# EAGLE board 519_jetson_nano10120 (EAGLE 9.6.2)
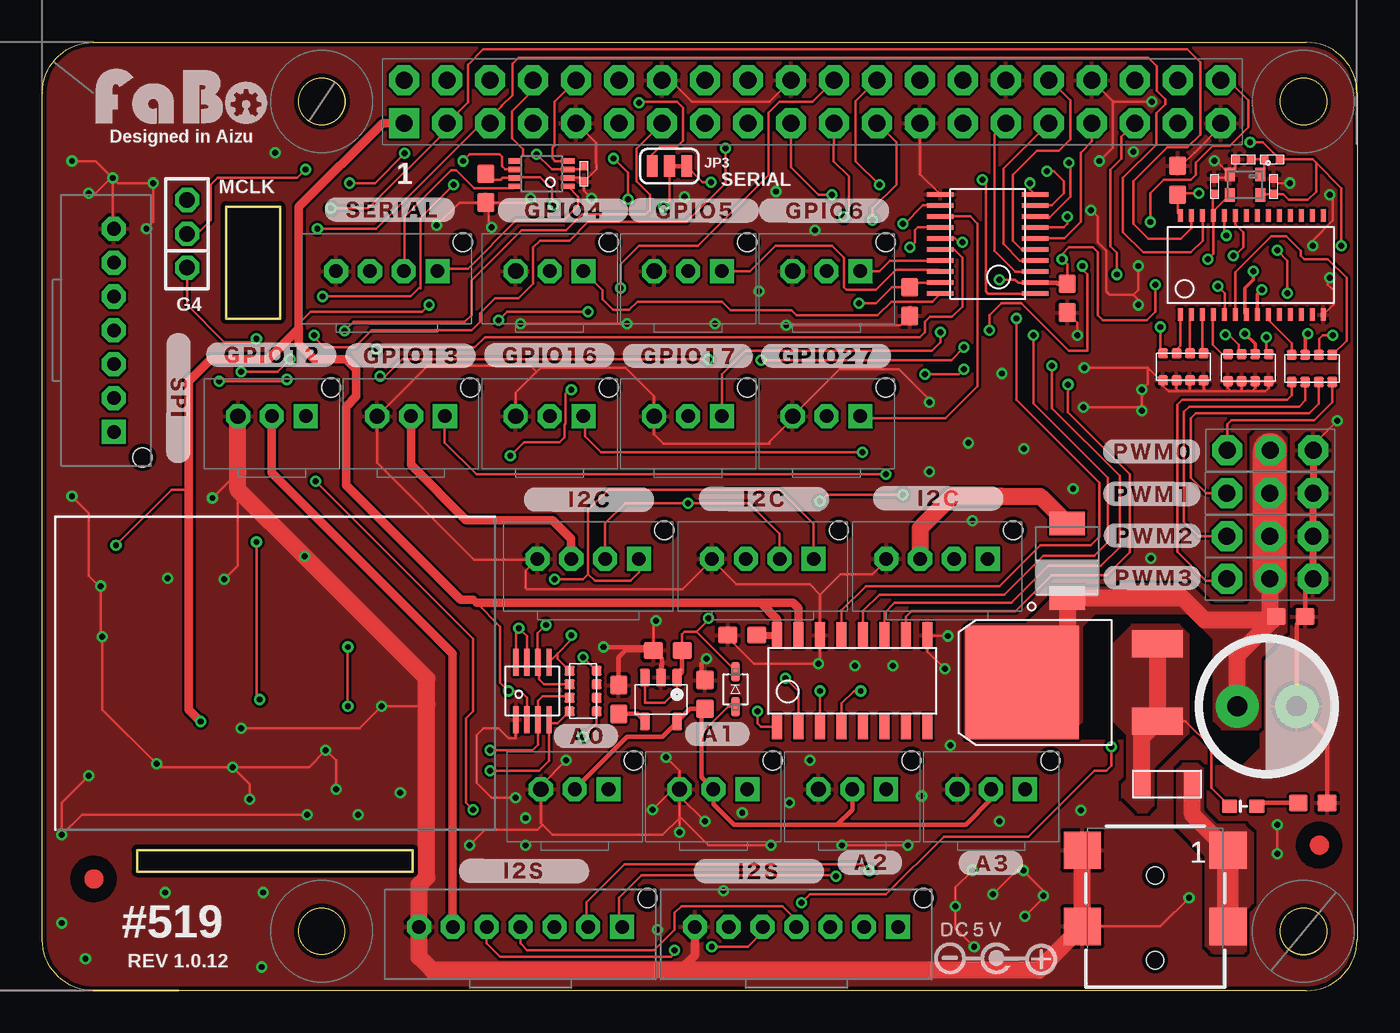
[diagram p1: board, top side]
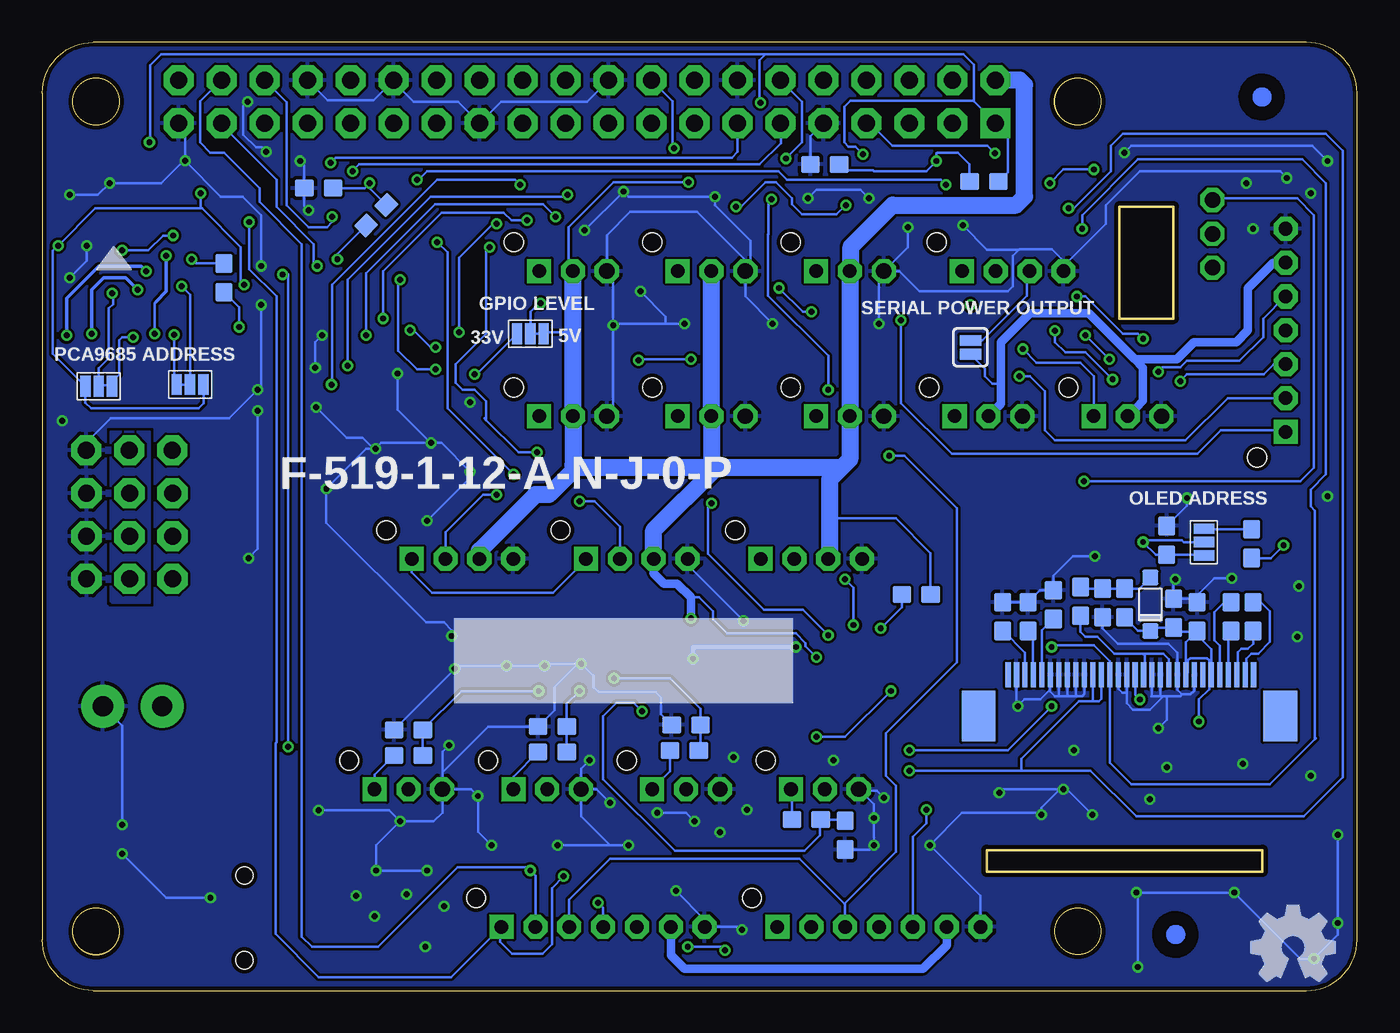
[diagram p2: board, bottom side, seen from below]

Size 70.28 x 51.77 mm. Coordinates in mm from the lower left corner, seen from the top.
Outline: 0,4.91 16.28,4.91 16.28,6.18 0,6.18 0,4.91
Outline: 5.25,44.17 8.45,44.17 8.45,37.58 5.25,37.58 5.25,44.17
Outline: circle at 10.91,50.4 radius 1.38
Outline: circle at 68.9,50.38 radius 1.38
Outline: circle at 10.9,1.38 radius 1.38
Outline: circle at 68.9,1.38 radius 1.38
Copper layers (1*16): Top 0.035mm / dielectric 1.6mm / Bottom 0.035mm
Design rules "PCBway": minimum track width 6mil, minimum drill 12mil, track to track 6mil, track to pad 6mil, pad to pad 6mil, via to via 6mil, smd to smd 6mil, copper to edge 10mil, drill to drill 10mil, minimum pad ring 10mil, minimum via ring 6mil, stop-mask expansion 2mil, vias tented up to drill 100mil, thermal gap 8mil
tKeepout: area -4.7,7.6 to 20.8,25.5
bKeepout: area -2.2,5.6 to 18.6,17.9; area 62.9,43.2 to 66.8,46.8
tRestrict: 12 lines
bRestrict: 8 lines

## Footprints (pad centres in the part's own frame; a part is rotated, then mirrored left to right if it is on the bottom)
FABO_BRICK_3PIN_B03B-PASK-1 = drill 0.9 pad 1.422 octagon: GND -2,0 | drill 0.8 pad 1.422 square: I/O 2,0 | drill 0.8 pad 1.422 octagon: VCC 0,0 | hole 1.1: 3.5,1.7
0603 = smd 1.1 x 1: 1 -0.85,0; 2 0.85,0
0402 = smd 0.5 x 0.5: P$1 -0.46,0; P$2 0.46,0
E7(PANA) = drill 1.2 pad 2.54: MINUS 1.75,0; PLUS -1.75,0
1N4148W = smd 0.9 x 0.95: ANODE 0,0; CATHODE 3.15,0
SOD-323 = smd 1.14 x 0.52: A 1.04,0; C -1.04,0
FABO_BRICK_I2C_B04B-PASK-1 = drill 0.8 pad 1.422 octagon: GND -3,0; SDA 1,0; VCC -1,0 | drill 0.8 pad 1.422 square: SCL 3,0 | hole 1.1: 4.5,1.7
SPI-B07B-PASK-1 = drill 0.8 pad 1.422 octagon: 1 -6,1.27; 2 -4,1.27; 3 -2,1.27; 4 0,1.27; 5 2,1.27; 6 4,1.27 | drill 0.8 pad 1.422 square: 7 6,1.27 | hole 1.1: 7.5,2.97
8PIN-SSOP = smd 0.3 x 1.6: 1 -0.975,-1.7; 2 -0.325,-1.7; 3 0.325,-1.7; 4 0.975,-1.7; 5 0.975,1.7; 6 0.325,1.7; 7 -0.325,1.7; 8 -0.975,1.7
MICROCHIP-MCP3008 = smd 0.6 x 1.5: 1 -4.445,-2.7; 2 -3.175,-2.7; 3 -1.905,-2.7; 4 -0.635,-2.7; 5 0.635,-2.7; 6 1.905,-2.7; 7 3.175,-2.7; 8 4.445,-2.7; 9 4.445,2.7; 10 3.175,2.7; 11 1.905,2.7; 12 0.635,2.7; 13 -0.635,2.7; 14 -1.905,2.7; 15 -3.175,2.7; 16 -4.445,2.7
694103107102 = smd 2.2 x 2.2: 1 4.3,4; 2 -4.3,-0.5; 3 -4.3,4; A1 4.3,-0.5 | hole 1: 0,-2.5; 0,2.5
JUMPERS_JP2-2MM = drill 0.914 octagon: 1 -2,0; 2 0,0; 3 2,0
SMT-JUMPER_2_NC_PASTE_SILK = smd 0.635 x 1.27: 1 -0.406,0; 2 0.406,0
SMT-JUMPER_3_1-NC_TRACE_SILK = smd 0.635 x 1.27: 1 -1.016,0; 2 0,0; 3 1.016,0
0603' = smd 0.9 x 0.8: ANODE -0.8,0; CATHODE 0.8,0
1206 = smd 1 x 1.6: P$1 -1.5,0; P$2 1.5,0
FABO_BRICK_3PIN_HEADER = drill 1 pad 1.778 octagon: GND -2.54,0; I/O 2.54,0; VCC 0,0
EXBV8V = smd 0.6 x 0.6: 1 -1.2,-0.8; 2 -0.4,-0.8; 3 0.4,-0.8; 4 1.2,-0.8; 5 1.2,0.8; 6 0.4,0.8; 7 -0.4,0.8; 8 -1.2,0.8
STPS15L30C = smd 1.6 x 3: A1 -2.286,-6.13; A2 2.286,-6.13 | smd 6.7 x 6.7: K 0,1.87
FABO_BRICK_SERIAL_B04B-PASK-1 = drill 0.8 pad 1.422 octagon: GND -3,0; TX 1,0; VCC -1,0 | drill 0.8 pad 1.422 square: RX 3,0 | hole 1.1: 4.5,1.7
SMD-JUMPER-3 = smd 0.61 x 1.219: 1 -0.787,0; 2 0,0; 3 0.787,0
ER-CON30HT-1 = smd 0.3 x 1.5 bottom: 1 7,-0.23; 2 6.5,-0.23; 3 6,-0.23; 4 5.5,-0.23; 5 5,-0.23; 6 4.5,-0.23; 7 4,-0.23; 8 3.5,-0.23; 9 3,-0.23; 10 2.5,-0.23; 11 2,-0.23; 12 1.5,-0.23; 13 1,-0.23; 14 0.5,-0.23; 15 0,-0.23; 16 -0.5,-0.23; 17 -1,-0.23; 18 -1.5,-0.23; 19 -2,-0.23; 20 -2.5,-0.23; 21 -3,-0.23; 22 -3.5,-0.23; 23 -4,-0.23; 24 -4.5,-0.23; 25 -5,-0.23; 26 -5.5,-0.23; 27 -6,-0.23; 28 -6.5,-0.23; 29 -7,-0.23; 30 -7.5,-0.23 | smd 2 x 3 bottom: 31 -9.07,-2.67; 32 8.74,-2.67
R-PUSON-N20 = smd 0.25 x 1.55: 1 -2.925,-2.8; 2 -2.275,-2.8; 3 -1.625,-2.8; 4 -0.975,-2.8; 5 -0.325,-2.8; 6 0.325,-2.8; 7 0.975,-2.8; 8 1.625,-2.8; 9 2.275,-2.8; 10 2.925,-2.8; 11 2.925,2.8; 12 2.275,2.8; 13 1.625,2.8; 14 0.975,2.8; 15 0.325,2.8; 16 -0.325,2.8; 17 -0.975,2.8; 18 -1.625,2.8; 19 -2.275,2.8; 20 -2.925,2.8
SOT-23-5 = smd 0.6 x 1.05: 1 -0.95,-1.3; 2 0,-1.3; 3 0.95,-1.3; 4 0.95,1.3; 5 -0.95,1.3
JETSON_NANO_COMPA = drill 1 pad 1.778 square: 1 -17.78,15.24 | drill 1 pad 1.778 octagon: 2 -17.78,17.78; 3 -15.24,15.24; 4 -15.24,17.78; 5 -12.7,15.24; 6 -12.7,17.78; 7 -10.16,15.24; 8 -10.16,17.78; 9 -7.62,15.24; 10 -7.62,17.78; 11 -5.08,15.24; 12 -5.08,17.78; 13 -2.54,15.24; 14 -2.54,17.78; 15 0,15.24; 16 0,17.78; 17 2.54,15.24; 18 2.54,17.78; 19 5.08,15.24; 20 5.08,17.78; 21 7.62,15.24; 22 7.62,17.78; 23 10.16,15.24; 24 10.16,17.78; 25 12.7,15.24; 26 12.7,17.78; 27 15.24,15.24; 28 15.24,17.78; 29 17.78,15.24; 30 17.78,17.78; 31 20.32,15.24; 32 20.32,17.78; 33 22.86,15.24; 34 22.86,17.78; 35 25.4,15.24; 36 25.4,17.78; 37 27.94,15.24; 38 27.94,17.78; 39 30.48,15.24; 40 30.48,17.78
VSSOP8 = smd 0.3 x 0.8: 1 -0.75,-1.55; 2 -0.25,-1.55; 3 0.25,-1.55; 4 0.75,-1.55; 5 0.75,1.55; 6 0.25,1.55; 7 -0.25,1.55; 8 -0.75,1.55
PCA9685 = smd 0.3 x 0.75: 1 -4.15,-2.93; 2 -3.5,-2.93; 3 -2.85,-2.93; 4 -2.2,-2.93; 5 -1.55,-2.93; 6 -0.9,-2.93; 7 -0.25,-2.93; 8 0.4,-2.93; 9 1.05,-2.93; 10 1.7,-2.93; 11 2.35,-2.93; 12 3,-2.93; 13 3.65,-2.93; 14 4.3,-2.93; 15 4.3,2.92; 16 3.65,2.92; 17 3,2.92; 18 2.35,2.92; 19 1.7,2.92; 20 1.05,2.92; 21 0.4,2.92; 22 -0.25,2.92; 23 -0.9,2.92; 24 -1.55,2.92; 25 -2.2,2.92; 26 -2.85,2.92; 27 -3.5,2.92; 28 -4.15,2.92
KC2016Z = smd 0.6 x 0.8: #1 -0.9,-0.6; #2 0.9,-0.6; #3 0.9,0.6; #4 -0.9,0.6
SOD-128 = smd 1.4 x 2.1: A -2.2,0; K 2.2,0

## Placement (x,y rotation side)
A0  [FABO_BRICK_3PIN_B03B-PASK-1]  25.85,9.77 0 top
A1  [FABO_BRICK_3PIN_B03B-PASK-1]  34.05,9.77 0 top
A2  [FABO_BRICK_3PIN_B03B-PASK-1]  42.25,9.77 0 top
A3  [FABO_BRICK_3PIN_B03B-PASK-1]  50.45,9.77 0 top
C1  10uF  [0603]  15.35,19.98 270 bottom
C2  10uF  [0603]  13.85,19.98 270 bottom
C3  10uF  [0603]  9.45,20.77 90 bottom
C4  1uF  [0603]  1.85,19.98 270 bottom
C5  1uF  [0603]  0.55,19.98 90 bottom
C6  1uF  [0603]  3.85,19.98 270 bottom
C7  0.1uF  [0603]  54.95,38.77 270 top
C8  10uF  [0603]  61.47,45.74 270 top
C9  0.1uF  [0603]  35.75,18.88 0 top
C10  0.1uF  [0603]  45.65,38.58 270 top
C11  1uF  [0603]  31.35,17.98 0 top
C12  0.1uF  [0603]  68.15,19.98 0 top
C13  0.1uF  [0402]  67.15,45.38 270 top
C14  20pF  [0402]  63.65,45.38 270 top
C15  1uF  [0603]  5.25,20.18 270 bottom
C16  0.01uF  [0603]  28.45,15.07 270 top
C17  4.7uF  [0603]  33.55,15.38 270 top
C18  0.1uF  [0402]  26.4,46.12 270 top
C19  0.1uF  [0603]  20.6,45.27 270 top
C100  OSCON  [E7(PANA)]  66.75,14.68 0 top
D1  1N4148  [1N4148W]  6.62,22.27 270 bottom
D2  1N4148WS  [SOD-323]  35.35,15.68 270 top
GPIO4  [FABO_BRICK_3PIN_B03B-PASK-1]  24.37,40.38 0 top
GPIO5  [FABO_BRICK_3PIN_B03B-PASK-1]  32.55,40.38 0 top
GPIO6  [FABO_BRICK_3PIN_B03B-PASK-1]  40.73,40.38 0 top
GPIO12  [FABO_BRICK_3PIN_B03B-PASK-1]  7.96,31.8 0 top
GPIO13  [FABO_BRICK_3PIN_B03B-PASK-1]  16.18,31.8 0 top
GPIO16  [FABO_BRICK_3PIN_B03B-PASK-1]  24.37,31.8 0 top
GPIO17  [FABO_BRICK_3PIN_B03B-PASK-1]  32.55,31.8 0 top
GPIO27  [FABO_BRICK_3PIN_B03B-PASK-1]  40.73,31.8 0 top
I2C0  [FABO_BRICK_I2C_B04B-PASK-1]  26.65,23.38 0 top
I2C1  [FABO_BRICK_I2C_B04B-PASK-1]  36.96,23.38 0 top
I2C2  [FABO_BRICK_I2C_B04B-PASK-1]  47.26,23.38 0 top
I2S0  FABO-I2S-7PIN  [SPI-B07B-PASK-1]  22.65,0.38 0 top
I2S1  FABO-I2S-7PIN  [SPI-B07B-PASK-1]  38.95,0.38 0 top
IC1  [8PIN-SSOP]  23.35,15.57 0 top
IC3  [MICROCHIP-MCP3008]  42.25,16.18 0 top
J1  [694103107102]  60.15,2.18 0 top
JP1  JUMPERS_JP2-2MM  [JUMPERS_JP2-2MM]  2.95,42.58 90 top
JP2  JUMPER-SMT_2_NC_PASTE_SILK  [SMT-JUMPER_2_NC_PASTE_SILK]  17.25,35.88 270 bottom
JP3  JUMPER-SMT_3_1-NC_TRACE_SILK  [SMT-JUMPER_3_1-NC_TRACE_SILK]  31.45,46.58 0 top
LED1  [0603']  65.35,8.77 0 top
LOGO1  [LOGO_FABO_M]  2.62,48.7 0 top
P1  MF-NSML600-2  [1206]  60.85,10.07 180 top
PWM0  [FABO_BRICK_3PIN_HEADER]  66.94,29.8 180 top
PWM1  [FABO_BRICK_3PIN_HEADER]  66.93,27.26 180 top
PWM2  [FABO_BRICK_3PIN_HEADER]  66.93,24.72 180 top
PWM3  [FABO_BRICK_3PIN_HEADER]  66.93,22.2 180 top
R1  10k  [EXBV8V]  61.81,34.72 0 top
R2  10k  [EXBV8V]  65.65,34.67 0 top
R3  220  [EXBV8V]  69.41,34.62 180 top
R4  4.7K/1%  [0603]  26.95,8 0 bottom
R5  1K  [0603]  69.45,8.98 0 top
R6  4.7K  [0603]  5.65,24.48 270 bottom
R7  0  [0402]  67.05,46.98 0 top
R8  10K  [EXBV8V]  26.35,15.57 270 top
R9  200K  [0603]  20.45,21.27 0 bottom
R10  9.1K/1%  [0603]  24.65,7.06 90 bottom
R11  4.7K/1%  [0603]  34.15,12.07 0 bottom
R12  4.7K/1%  [0603]  41.95,11.98 0 bottom
R13  4.7K/1%  [0603]  50.45,11.77 0 bottom
R14  9.1K/1%  [0603]  34.05,13.57 0 bottom
R15  9.1K/1%  [0603]  41.95,13.48 0 bottom
R16  9.1K/1%  [0603]  50.45,13.27 0 bottom
R17  20K  [0603]  16.45,45.67 0 bottom
R18  NC  [0603]  61.35,39.98 90 bottom
R19  390K  [0603]  12.35,20.67 270 bottom
R20  4.7K  [0603]  0.65,24.27 270 bottom
R21  1M  [0603]  25.85,46.67 0 bottom
R22  DNP  [0402]  65.35,46.98 0 top
R23  20K  [0603]  52.35,43.67 225 bottom
R24  1M  [0603]  55.75,45.27 0 bottom
R25  100  [0603]  10.75,20.88 90 bottom
R26  10K  [0603]  8.15,20.77 270 bottom
S1  STPS15L30CB  [STPS15L30C]  54.15,16.07 90 top
SERIAL  [FABO_BRICK_SERIAL_B04B-PASK-1]  14.75,40.38 0 top
SJ2  [SMD-JUMPER-3]  68.75,33.58 0 bottom
SJ3  [SMD-JUMPER-3]  43.25,36.67 0 bottom
SJ5  [SMD-JUMPER-3]  63.35,33.67 180 bottom
SJ6  [SMD-JUMPER-3]  3.45,24.38 270 bottom
SPI1  FABO-SPI-7PIN  [SPI-B07B-PASK-1]  -2.65,36.88 270 top
U1  [ER-CON30HT-1]  8.02,16.77 0 top
U2  TXB0108  [R-PUSON-N20]  50.25,41.98 90 top
U7  LP2985-50  [SOT-23-5]  30.95,15.07 180 top
U$2  JETSON_NANOJETSON_NANO_COMPA  [JETSON_NANO_COMPA]  33.55,33.88 0 top
U$3  [MARK_POINT_3MM]  -2.55,4.48 0 top
U$4  [MARK_POINT_3MM]  69.85,6.48 0 top
U$5  [MARK_POINT_3MM]  5.12,1.2 0 bottom
U$6  [MARK_POINT_3MM]  0.02,50.66 0 bottom
U$7  TXB0102  [VSSOP8]  23.9,46.12 90 top
U$8  LOGO_OSHW-M_BOTTOM  [LOGO_OSHW_M_BOTTOM]  -1.82,0.44 0 top
U$9  PCA9685  [PCA9685]  65.78,40.74 0 top
U$11  KC2016Z  [KC2016Z]  65.45,45.48 180 top
U$12  PMEG10030ELP  [SOD-128]  54.95,23.27 270 top

## Tracks (layer width: path | path; a pad name or v marks a point on that pad's centre or on a via)
3V3  (via drill 0.35)
  Top 0.152: C8.2 61.47,44.83 | v-1.25,24.17 2.05,27.48 3.05,27.48 | v17.25,38.38 16.85,37.98 10.25,37.98 9.55,37.27 | R8.6 R8.5 27.15,13.68 v26.35,12.88 | IC1.2 23.05,13.9 23.05,15.18 22.65,15.57 v21.95,15.57 21.45,16.07 21.45,19.38 20.05,20.77 19.85,20.98 | U$11.#4 66.39,44.91 C13.P$2 67.71,44.91 68.05,44.58 69.15,44.58 69.65,45.08 69.65,46.77 | U$9.28 61.47,43.82 C8.2 | v65.75,47.98 66.51,47.98 R7.P$2 69.45,46.98 69.65,46.77 | C7.1 54.95,40.77 v54.65,41.08 54.65,41.38 55.05,41.77 56.45,41.77 56.75,41.48 56.75,37.77 57.05,37.48 59.65,37.48 60.15,37.98 v60.15,39.58 | v62.72,44.97 61.56,44.97 C8.2 | 69.65,46.77 71.15,45.27 v71.15,41.88 | C18.P$1 26.19,46.38 U$7.3 24.5,46.38 v23.6,47.27 | JP3.1 30.43,47.26 30.9,47.73 31.9,47.73 32.25,48.08 32.25,50.02 31.9,50.38 29.7,50.38 v29.65,50.33 | v46.55,34.27 48.55,34.27 v48.85,34.58 | v50.95,39.88 51.85,39.88 52.05,39.67 53.03,39.67 U2.2
  Top 0.254: C7.1 54.4,39.62 54.35,39.67 53.08,39.67 U2.2
  Top 0.406: C9.2 IC3.16
  Top 0.508: U$2.1 14.49,49.12 9.55,44.17 9.55,37.27 9.55,36.98 | 9.55,36.98 9.55,36.08 10.45,35.17 12.35,35.17 12.95,34.58 12.95,32.98 12.35,32.38 12.35,27.73 19.1,20.98 19.85,20.98 | 9.55,36.98 7.75,35.17 4.35,35.17 3.05,33.88 3.05,27.48 3.05,14.48 v3.75,13.77 | 20.05,20.77 36.85,20.77 | 36.85,20.77 37.8,19.82 IC3.16 | IC3.15 39.08,20.45 38.75,20.77 36.85,20.77
  Bottom 0.152: U1.25 3.02,18.05 3.85,18.88 3.85,19.07 | 3.85,19.07 C6.2 4.52,18.45 U1.22 4.4,16.66 4.4,17.38 4.27,17.51 3.27,17.51 3.14,17.38 3.14,15.69 3.75,15.08 v3.75,13.77 | 3.85,19.07 5,19.07 C15.2 6.42,19.32 D1.CATHODE 7.35,19.12 R26.2 | 29.35,53.17 65.05,53.17 65.7,52.53 65.7,48.02 v65.75,47.98 | 29.35,53.17 17.65,53.17 17.05,52.58 17.05,50.4 | 17.05,50.4 U$2.1 15.05,48.4 15.05,46.23 R17.2 | R20.2 -0.5,23.42 v-1.25,24.17 | v26.35,12.88 24.65,12.88 v21.95,15.57 | v17.25,38.38 17.35,38.27 | R23.2 54.65,41.38 v54.65,41.08 | v60.15,39.58 60.35,39.77 60.35,40.54 60.36,40.55 60.36,41.78 62.65,44.08 | 62.65,44.08 68.95,44.08 v71.15,41.88 71.45,41.58 71.45,35.49 SJ2.1 69.54,32.61 69.2,32.27 62.85,32.27 62.55,32.58 62.55,33.66 SJ5.1 | v62.72,44.97 62.72,44.15 62.65,44.08 | v23.6,47.27 24.05,47.73 24.45,47.73 24.7,47.98 24.7,50.08 24.35,50.42 17.08,50.42 17.05,50.4 | v29.65,50.33 29.7,50.38 29.7,52.83 29.35,53.17 | SJ3.1 46.49,34.22 v46.55,34.27 | v48.85,34.58 49.95,34.58 51.05,35.67 51.05,39.77 v50.95,39.88
5V  (via drill 0.35)
  Top 0.152: U7.1 31.9,15.62 31.15,14.88 30,14.88 U7.3 | U2.19 46.17,39.7 45.9,39.42 C10.1 44.6,39.42 43.65,38.48 v42.65,38.48 | D2.C 35.35,16.77 33.05,19.07 | 33.05,19.07 32.35,19.07 32.2,18.93 C11.2 | R8.7 R8.8 v26.35,17.57 | 33.05,19.07 33.75,19.77 v33.75,19.88 | 50.85,27.38 51.15,27.08 | JP3.3 33.42,45.62 v33.9,45.62
  Top 0.254: U7.1 32.2,16.68 C11.2
  Top 0.508: I2S0.2 18.65,17.77 7.96,28.47 GPIO12.VCC | GPIO13.VCC 16.18,28.95 19.45,25.67 24.55,25.67 25.65,24.58 I2C0.VCC
  Top 1.016: U$12.A 53.35,27.08 51.15,27.08 48.15,27.08 46.26,25.19 I2C2.VCC
  Bottom 0.152: v26.35,17.57 26.99,18.22 26.99,18.41 27.56,18.98 31.62,18.98 32.45,19.8 32.45,20.27 33.28,21.1 33.75,21.1 | R9.2 19.6,23.73 21.65,25.77 25.55,25.77 | v33.9,45.62 37.51,45.62 37.52,45.63 38.34,45.63 41,42.98 41,40.65 GPIO6.VCC | JP2.2 16.4,34.62 16.4,34.17 15.95,33.73 15.45,33.73 | v42.65,38.48 42.75,38.48 43.25,37.98 SJ3.2 SJ3.3 42.36,36.77 40.73,36.77
  Bottom 0.254: 15.56,34.26 15.45,34.38
  Bottom 0.5: 7.46,32.3 GPIO12.VCC | 15.45,32.56 15.45,33.73 15.45,34.38 15.45,36.17 13.75,37.88 10.25,37.88 | v33.75,19.88 33.75,21.1
  Bottom 0.508: 10.25,37.88 7.55,35.17 | 7.55,35.17 7.05,34.67 7.05,32.72 7.46,32.3 | 7.55,35.17 5.05,35.17 4.05,36.17 1.55,36.17 0.85,36.88 0.85,39.38 -0.65,40.88 SPI1.2 | I2S0.2 18.65,0.57 20.05,-0.82 34.15,-0.82 34.95,-0.03 I2S1.2 | 15.45,32.56 15.45,32.53 GPIO13.VCC | 33.75,21.1 34.57,21.92 35.35,21.92 35.96,22.53 I2C1.VCC
  Bottom 1: 14.55,44.27 21.85,44.27 24.3,41.83 | I2C0.VCC 25.55,23.48 25.55,25.77 | I2C1.VCC 35.96,25.06 32.26,28.77
  Bottom 1.016: 32.26,28.77 40.56,28.77 | 40.56,28.77 42.15,27.17 42.95,27.17 46.26,23.87 I2C2.VCC | 14.55,44.27 14.05,44.77 14.05,51.38 14.33,51.66 U$2.2 | 24.86,28.77 24.37,29.26 GPIO16.VCC GPIO4.VCC 24.3,40.45 24.3,41.83 | 24.86,28.77 32.26,28.77 | 25.55,25.77 25.55,28.08 24.86,28.77 | 32.26,28.77 32.55,29.05 GPIO17.VCC GPIO5.VCC | 40.56,28.77 40.73,28.94 GPIO27.VCC 40.73,36.77 GPIO6.VCC
  pour Bottom (no thermals): 65.75,30.88 68.05,30.88 68.05,20.88 67.95,20.77 65.75,20.77
+5
  Top 0.152: D2.A 34.91,14.64 33.35,13.07
  Top 0.254: A0.VCC 28.95,12.88 31.05,12.88 31.9,13.73 U7.5 32.65,14.52 C17.2 33.35,14.32 33.35,13.07 33.35,10.48 A1.VCC 34.05,8.88 35.25,7.68 41.35,7.68 | A2.VCC 42.25,8.57 41.35,7.68 | 41.35,7.68 48.95,7.68 50.45,9.18 A3.VCC
CH0
  Bottom 0.152: R4.1 27.8,9.72 A0.I/O
CH1
  Bottom 0.152: A1.I/O 35,10.82 R11.1
CH2
  Bottom 0.152: R12.1 44.25,10.52 A2.I/O
CH3
  Bottom 0.152: R13.1 52.45,10.62 A3.I/O
GND  (via drill 0.35)
  Top 0.152: R2.1 64.45,33.48 64.65,33.27 | 64.65,33.27 65.15,33.27 | 65.15,33.27 65.25,33.38 R2.2 | R2.3 66.05,33.48 65.85,33.27 | 65.85,33.27 65.15,33.27 | R1.4 63.01,33.42 63.15,33.27 | 63.15,33.27 64.65,33.27 | R1.1 60.61,33.77 | 60.61,33.77 60.61,33.62 60.95,33.27 61.55,33.27 | 61.55,33.27 62.15,33.27 | R1.3 62.21,33.33 62.15,33.27 | R1.2 61.41,33.42 61.55,33.27 | U$9.14 70.68,38.41 70.68,39.24 70.35,39.58 70.35,39.88 v70.45,39.98 | R2.4 66.85,33.48 66.65,33.27 65.85,33.27 | 17.11,14.77 17.01,14.68 v14.45,14.68 13.15,13.38 v6.15,13.38 | v5.15,22.17 5.95,22.98 5.95,27.48 | v4.45,26.98 5.95,28.48 | C11.1 30.5,19.58 v30.65,19.73 | C14.P$1 63.69,45.88 64.35,45.88 U$11.#2 | U$11.#2 64.89,46.41 R22.P$1 | U$2.25 46.25,46.1 U2.11 | U$11.#2 63.74,46.88 v63.64,46.88 | C8.1 61.67,46.59 62.45,47.37 62.48,47.37 64.03,48.92 U$2.39 | v56.85,46.88 57.64,47.67 57.64,48.24 57.65,48.25 57.65,50.41 | U$2.34 57.65,50.41 | 23.95,7.68 23.85,7.77 A0.GND 23.85,9.98 v25.35,11.48 | 23.95,7.68 24.55,7.07 31.05,7.07 32.04,8.06 | 32.05,8.18 32.05,8.07 32.04,8.06 | 32.05,8.18 32.05,9.38 | 32.05,9.38 32.05,9.68 | 32.05,9.68 A1.GND 32.05,10.88 v31.25,11.68 | v37.45,6.48 33.75,6.48 32.05,8.18 | v19.65,6.48 20.55,7.38 23.65,7.38 23.95,7.68 | IC3.14 40.34,18.57 | 40.34,18.57 40.34,17.27 40.3,17.23 | 40.3,17.23 v40.25,17.18 36.45,17.18 34.9,18.73 C9.1 | 40.35,21.27 41.55,22.48 43.43,22.48 44.26,23.3 I2C2.GND | 40.34,18.57 40.35,18.58 40.35,21.27 | IC3.9 46.55,18.73 | 40.45,17.07 40.3,17.23 | 40.35,21.27 39.75,21.88 35.4,21.88 33.96,23.31 | 23.6,23.33 22.95,22.67 22.95,21.67 23.05,21.58 32.22,21.58 33.96,23.31 | 23.6,23.33 I2C0.GND | 23.6,23.33 19.9,23.33 14.18,29.05 GPIO13.GND 17.12,34.74 17.12,34.77 23.25,34.77 23.6,34.42
  Top 0.152: 23.6,34.42 22.37,33.2 GPIO16.GND | 23.6,34.42 23.85,34.67 28.85,34.67 30.55,32.98 GPIO17.GND 30.55,30.73 31.1,30.17 37.25,30.17 | J1.2 60.45,1.68 v62.15,3.38 | v67.35,5.98 v67.35,7.68 | v-1.45,45.88 -1.45,42.95 SPI1.1 | U$2.14 31.51,51.66 32.79,50.38 37.35,50.38 U$2.20 | v56.35,43.98 56.75,43.58 56.75,42.08 57.25,41.58 57.25,39.17 57.45,38.98 58.85,38.98 | v59.15,40.67 59.15,39.27 58.85,38.98 | C10.2 45.1,37.17 v38.35,37.17 | v28.95,37.27 v22.65,37.27 | C7.2 55.55,37.33 v55.55,36.58 | v55.95,34.67 59.71,34.67 | 59.71,34.67 60.61,33.77 | 59.71,34.67 59.71,33.73 v59.35,33.38 v59.35,32.12 59.15,32.33 v55.9,32.33 | 58.85,38.98 59.15,38.67 v59.15,38.38 | v68.09,45.58 67.41,45.58 C13.P$1 | v69.45,41.88 69.45,42.17 70.65,43.38 70.65,44.67 v70.45,44.88 | v32.04,7.23 32.04,8.06 | v30.45,8.57 31.56,9.68 32.05,9.68 | v33.55,7.88 32.05,9.38 | v49.35,4.98 48.35,3.97 v48.35,2.88 48.35,1.57 v49.45,0.47 | v50.55,3.57 51.95,4.98 v52.35,4.98 53.55,3.78 v53.55,3.47 53.55,3.38 v52.45,2.28 | IC1.1 22.35,13.85 22.35,12.77 21.95,12.77 21.35,13.38 20.45,13.38 20.05,12.98 20.05,10.17 20.95,9.27 v22.35,9.27 | v11.75,9.77 11.75,11.48 v11.15,12.07 10.15,11.07 v5.65,11.07 | v5.65,11.07 1.35,11.07 v1.15,11.27 -2.05,14.48 v-2.05,18.77 -2.15,18.88 v-2.15,21.77 -2.25,21.77 -2.85,22.38 -2.85,26.08 v-3.85,27.08 | v10.05,8.27 -3.25,8.27 v-4.45,7.07 -4.45,8.98 v-2.85,10.57 | v-3.85,46.88 -2.45,46.88 -1.5,45.92 | -1.5,45.92 v-1.45,45.88 | v-2.85,44.98 -2.45,44.98 -1.5,45.92 | v-1.45,45.88 -1.15,45.58 v0.95,45.58 0.95,43.27 v0.55,42.88 | v5.65,11.07 6.65,10.07 v6.65,9.18 | v41.65,6.48 v45.55,6.48 | IC3.9 46.7,17.91 v47.72,16.89
  Top 0.152: IC3.9 46.74,18.82 v47.9,18.82 | v46.8,32.62 46.8,32.77 45,34.58 41.5,34.58 GPIO27.GND 38.73,31.66 37.25,30.17 | v59.94,50.38 57.69,50.38 57.65,50.41 | 37.25,30.17 37.35,30.17 | I2C1.GND 33.96,23.31 | 62.15,33.27 63.15,33.27 | PWM0.GND 69.48,30.1 v70.9,31.52 | U$7.2 26.19,45.88 C18.P$2 | 20.75,44.42 C19.2 19.05,44.42 v17.7,43.08 | 20.75,44.42 23,44.42 v23.25,44.67 | v26.85,44.67 26.4,45.12 C18.P$2 | U$2.9 27.1,47.95 27.1,46.71 27.13,46.68 27.13,46.39 C18.P$2 | v20.95,42.98 20.75,43.17 20.75,44.42
  Top 0.254: R5.2 70.3,12.88 C100.MINUS 68.5,19.48 C12.2 69,21.73 PWM3.GND | U7.2 30.95,17.07 31,17.02 31,17.48 C11.1 | C16.1 28.45,17.57 28.85,17.98 C11.1 | C17.1 33.35,16.43 33.35,17.18 v33.65,17.48 | v27.55,18.18 30.3,18.18 C11.1
  Top 0.406: PWM0.GND PWM1.GND PWM2.GND PWM3.GND
  Top 0.508: I2S1.1 32.95,-0.03 32.05,-0.93
  Top 1: J1.3 J1.2 53.25,-0.93 32.05,-0.93 17.45,-0.93 16.65,-0.12 I2S0.1 16.65,4.11 17.11,4.57 17.11,14.77 17.11,16.32 v9.9,23.52 5.95,27.48 5.95,28.48 GPIO12.GND
  Bottom 0.152: U1.6 12.55,16.54 12.55,15.77 | 3.95,16.46 U1.23 4.02,15.61 4.25,15.38 4.75,15.38 | 4.75,15.38 5.02,15.64 U1.21 5.02,17.84 5.55,18.38 8.55,18.38 9.45,19.27 C3.1 | U1.15 8.02,15.45 | 8.02,15.45 8.02,14.84 7.65,14.48 6.65,14.48 5.85,15.27 | 5.95,15.27 6.55,15.27 6.52,15.3 U1.18 | 5.95,15.27 5.85,15.27 | 5.85,15.27 5.65,15.27 | 5.65,15.27 4.85,15.27 4.75,15.38 | U1.19 6.02,15.34 5.95,15.27 | 8.02,15.45 8.06,15.48 8.29,15.48 8.52,15.72 U1.14 | C1.1 C2.1 13.15,21.52 R19.1 12.35,22.38 11.2,23.52 v9.9,23.52 | 4.05,21.02 C15.1 5.25,22.08 v5.15,22.17 | 4.05,21.02 C6.1 | U1.2 14.52,14.75 v14.45,14.68 14.05,15.07 13.12,15.07 12.56,15.64 12.56,15.77 12.55,15.77 | v6.15,13.38 5.65,13.88 5.65,15.27 | R6.1 4.45,26.52 v4.45,26.98 | v63.64,46.88 63.64,48.73 U$2.39 | v56.85,46.88 56.6,46.62 R24.1 56.6,44.23 v56.35,43.98 | U$2.34 55.23,50.48 52.51,50.48 U$2.30 51.33,51.55 50.15,50.38 47.51,50.38 U$2.25 44.99,50.38 39.91,50.38 U$2.20 | v63.64,46.88 63.69,46.93 65.05,45.58 v68.09,45.58 68.79,44.88 v70.45,44.88 | v63.64,46.88 61.54,44.77 60.25,44.77 59.15,43.67 v59.15,40.67 | A2.GND 40.25,8.18 38.55,6.48 | 38.55,6.48 v37.45,6.48 | I2S0.1 16.65,3.47 v19.65,6.48 17.75,8.38 13.15,8.38 v13.05,8.27 13.05,8.68 11.95,9.77 | v62.15,3.38 64.75,3.38 v67.35,5.98 | v67.35,7.68 67.35,13.52 C100.MINUS | GPIO4.GND 21.45,40.38 20.25,39.17 15.05,39.17 14.75,39.48 14.75,41.27 14.38,41.65 | 14.38,41.65 14.35,41.67 12.45,41.67 11.75,40.98 SERIAL.GND 11.75,40.67 9.25,43.17 9.25,44.27 7.25,46.27 -1.05,46.27 v-1.45,45.88 | v55.55,36.58 55.95,36.17 v55.95,34.67 | PWM0.GND 69.48,30.24 68.05,31.67 61.05,31.67 v59.35,33.38 59.15,33.58 v59.15,38.38
  Bottom 0.152: v70.45,39.98 69.45,40.98 v69.45,41.88 | R14.1 35.52,14.2 35.52,15.18 35.87,15.52 39.23,15.52 39.51,15.81 39.51,16.47 40.22,17.18 v40.25,17.18 | v40.25,17.18 40.45,17.18 41.82,15.8 41.82,14.45 R15.1 45.73,13.48 48.43,10.78 | R16.1 47.72,16.86 | 47.72,16.86 v47.72,16.89 | v33.55,7.88 34.05,8.38 v35.75,8.38 | v38.55,8.98 39.35,9.77 A2.GND | v39.75,11.48 40.25,10.98 A2.GND | R10.1 23.21,6.21 v22.95,6.48 v22.95,8.07 22.95,8.88 23.77,9.7 | 23.77,9.7 A0.GND | v22.35,9.27 22.77,9.7 23.77,9.7 | v34.65,3.78 32.95,2.07 I2S1.1 30.92,1.64 v30.75,1.47 | v49.35,4.98 v52.35,4.98 52.35,6.48 v50.95,7.88 | v50.95,7.88 48.95,7.88 48.43,8.4 48.43,10.78 | U1.10 10.52,15.41 10.65,15.28 10.95,15.28 | 10.95,15.28 11.45,15.28 | 11.45,15.28 12.05,15.28 | 12.05,15.28 12.25,15.28 12.55,15.57 12.55,15.77 | U1.9 11.02,15.35 10.95,15.28 | U1.8 11.52,15.35 11.45,15.28 | U1.7 12.02,15.31 12.05,15.28 | v10.05,8.27 11.55,9.77 v11.75,9.77 11.95,9.77 | 11.95,9.77 15.35,9.77 v15.55,9.57 | v-4.45,7.07 v-4.45,1.88 -4.45,1.18 v-3.05,-0.22 -2.25,-0.22 v1.65,3.68 v7.45,3.68 7.35,3.57 v7.35,-0.72 | v-3.85,46.88 -2.95,47.77 7.75,47.77 v8.15,47.38 | v40.05,42.77 v37.75,45.08 37.45,44.77 v32.35,44.77 32.35,44.27 30.25,42.17 30.25,40.38 GPIO5.GND | 48.43,10.78 48.43,12 v48.05,12.38 | v50.95,7.88 51.6,8.52 v55.75,8.52 | v45.55,6.48 46.35,7.27 v46.35,9.38 46.75,9.77 A3.GND | v41.65,6.48 38.55,6.48 | v40.25,17.18 42.3,17.18 v42.4,17.07 v44.65,17.07 47.5,17.07 47.72,16.86 | v49.35,25.62 46.8,28.17 v46.8,28.52 48.5,30.23 v49.1,30.23 49.15,30.23 | 49.15,30.23 52.05,30.23 v52.4,29.88 | v52.4,29.88 52.95,29.88 v55.3,27.52 55.3,25.52 49.4,19.62 48.35,19.62 47.9,19.18 v47.9,18.82
  Bottom 0.152: v58.85,47.42 59.1,47.67 59.45,47.67 60.2,48.42 60.2,50.12 v59.94,50.38 | GPIO4.GND 22.65,40.09 v22.65,37.27 | GPIO5.GND 30.55,38.88 v28.95,37.27 | GPIO5.GND 30.55,41.02 33.4,43.88 37.35,43.88 38.73,42.49 GPIO6.GND 38.35,39.99 v38.35,37.17 | v30.65,19.73 33.96,23.04 I2C1.GND | v59.9,23.42 59.35,23.98 v59.35,32.12 | v55.9,32.33 54.1,30.52 53.15,30.52 52.5,29.88 v52.4,29.88 | v1.8,22.23 2.85,22.23 4.05,21.02 | U$2.9 26.7,48.34 R21.1 | v23.25,44.67 23.75,45.17 26.35,45.17 v26.85,44.67 | GPIO4.GND 20.95,41.8 v20.95,42.98 | v17.7,43.08 16.27,41.65 14.38,41.65 | GPIO27.GND 38.35,32.19 v38.35,37.17 | v34.15,37.27 35.25,37.27 | 35.25,37.27 38.25,37.27 v38.35,37.17 | v36.75,39.17 35.25,37.67 35.25,37.27 | v51.1,34.33 51.1,32.17 49.15,30.23
  Bottom 0.254: v33.65,17.48 33.65,18.18 v27.55,18.18
  pour Bottom (rank 5): -5.75,-2.99 72.99,-2.99 72.99,54.22 -5.75,54.22
  pour Top (rank 5): -5.75,-3.2 72.89,-3.2 72.89,54.22 -5.75,54.22
GPIO4  (via drill 0.35)
  Top 0.152: v12.55,45.58 14.05,45.58 v15.8,47.33 | JP1.2 3.55,42.58 4.35,43.38 4.35,45.48 4.75,45.88 9.45,45.88 v9.95,46.38
  Bottom 0.152: v9.95,46.38 11.75,46.38 v12.55,45.58 | U$2.7 23.19,49.12 21.85,47.77 16.25,47.77 v15.8,47.33
GPIO5
  Top 0.152: U2.3 51.88,40.35 50.65,41.58 50.65,48.44 U$2.29
GPIO6
  Top 0.152: U2.4 52.16,41 51.17,41.99 51.17,46.41 U$2.31
GPIO12
  Top 0.152: U2.5 52.28,41.65 51.75,42.17 51.75,46.08 53.15,47.48 54.45,47.48 55.15,48.17 55.15,50.48 53.97,51.66 U$2.32
GPIO13
  Top 0.152: U2.6 54.78,42.3 55.75,43.27 55.75,47.38 56.41,48.03 U$2.33
GPIO16/UART1_CTS  (via drill 0.35)
  Top 0.152: U2.7 53.08,42.98 54.75,42.98 54.95,43.17 v54.95,43.58
  Bottom 0.152: U$2.36 57.65,50.35 57.65,44.27 56.35,42.98 55.25,42.98 54.95,43.27 v54.95,43.58
GPIO17/UART1_RTS  (via drill 0.35)
  Top 0.152: U2.9 53.08,44.27 54.05,44.27 54.75,44.98 54.75,45.67 54.15,46.27 v53.75,46.27
  Bottom 0.152: v53.75,46.27 53.35,46.67 29.7,46.67 28.45,47.92 28.45,49.09 U$2.11
GPIO24/SPI1_CS0  (via drill 0.35)
  Top 0.152: v34.75,47.63 34.75,45.58 32.45,43.27 26.65,43.27 25.55,42.17 23.8,42.17 23.4,41.77 23.4,39.62 22.55,38.77 21.15,38.77 20.25,37.88 20.25,37.38 19.75,36.88 13.85,36.88 12.85,35.88 11.05,35.88 10.45,36.48 v10.45,36.58 | v9.05,35.17 8.32,34.44 v6.15,34.44
  Bottom 0.152: U$2.18 34.85,50.41 34.85,47.73 v34.75,47.63 | v10.45,36.58 v9.05,35.17 | v6.15,34.44 5.9,34.69 4.85,34.69 4.47,35.08 1.35,35.08 -0.05,36.48 -0.05,37.58 -1.35,38.88 SPI1.3
GPIO25/SPI1_MISO  (via drill 0.35)
  Top 0.152: U$2.22 39.89,50.38 37.95,50.38 37.3,49.73 37.3,46.02 33.15,41.88 29.65,41.88 28.55,40.77 v28.55,39.38 | v26.65,37.98 21.85,37.98 v21.35,37.48
  Bottom 0.152: v21.35,37.48 21.35,32.58 18.35,29.58 3.85,29.58 2.45,30.98 -1.28,30.98 SPI1.7 | v28.55,39.38 27.15,37.98 v26.65,37.98
GPIO26/SPI1_MOSI  (via drill 0.35)
  Top 0.152: v55.85,40.67 55.85,40.48 56.15,40.17 56.15,35.67 55.05,35.67 52.25,38.48 51.05,38.48 50.35,37.77 v50.35,36.88 | 36.91,35.17 v36.85,35.12 48.09,35.12 v48.85,35.88 | v33.75,35.17 15.65,35.17 14.65,34.17 v14.35,34.17
  Bottom 0.152: U$2.37 61.49,49.02 58.25,45.77 58.25,44.17 56.05,41.98 56.05,40.88 v55.85,40.67 | v50.35,36.88 50.15,36.88 49.15,35.88 v48.85,35.88 | v36.85,35.12 36.79,35.17 v33.75,35.17 | SPI1.6 2.05,32.88 4.55,30.38 12.25,30.38 12.85,30.98 12.85,33.27 13.75,34.17 v14.35,34.17
GPIO27/SPI1_SCK  (via drill 0.35)
  Top 0.152: U2.8 53.83,43.6 53.9,43.52 55.15,44.77 55.15,46.67 v55.05,46.77 | v12.25,36.84 12.78,37.38 19.35,37.38 19.75,37.77 19.75,39.83 22.7,42.77 25.35,42.77 26.3,43.73 30.05,43.73 30.3,43.98 30.3,44.88 29.5,45.67 29.5,47.6 U$2.13 | v8.85,33.98 8.75,33.88 v4.85,33.88
  Bottom 0.152: U$2.13 31.01,47.41 31.35,47.08 54.75,47.08 v55.05,46.77 | v4.85,33.88 4.45,34.27 -0.08,34.27 -0.68,34.88 SPI1.5 | v8.85,33.98 10.45,35.58 11.65,35.58 12.25,36.17 v12.25,36.84
H_SCL  (via drill 0.35)
  Top 0.152: I2C0.SCL 29.65,22.58 29.15,22.08 27.05,22.08 26.65,22.48 | I2C1.SCL 39.96,25.47 37.95,27.48 27.85,27.48 26.65,26.27 26.65,22.48 | v24.15,19.48 23.65,18.98 23.65,17.3 IC1.6 23.75,17.2 23.75,16.27 24.05,15.98 R8.2 | v24.65,22.17 26.35,22.17 26.65,22.48
  Bottom 0.152: v24.15,19.48 24.15,21.67 v24.65,22.17 | I2C2.SCL 50.25,22.58 49.05,21.38 41.9,21.38 39.96,23.31 I2C1.SCL
H_SDA  (via drill 0.35)
  Top 0.152: I2C0.SDA 27.65,25.48 28.85,26.67 v32.55,26.67 36.15,26.67 37.96,24.87 I2C1.SDA | IC1.5 24.84,17.79 | 24.84,17.79 25.65,18.6 v25.65,18.88 | R8.1 24.84,17.49 24.84,17.79 | v40.35,26.77 40.75,27.17 v45.25,27.17
  Bottom 0.152: v25.65,18.88 27.15,20.38 29.45,20.38 32.75,23.67 32.75,26.48 v32.55,26.67 | I2C1.SDA 37.96,25.28 39.45,26.77 v40.35,26.77 | v45.25,27.17 46.05,27.17 48.26,24.97 I2C2.SDA
I2S0_DIN  (via drill 0.35)
  Top 0.152: I2S0.6 26.55,1.74 26.55,3.1 28.81,5.36 42.87,5.36 v43.25,4.98
  Bottom 0.152: U$2.38 62.75,50.4 62.75,47.98 62.15,47.38 61.35,47.38 59.25,45.27 59.25,44.48 56.75,41.98 56.75,1.07 56.15,0.47 52.25,0.47 47.55,5.18 43.45,5.18 v43.25,4.98 42.95,4.68 I2S1.6
I2S0_DOUT  (via drill 0.35)
  Top 0.152: U$2.40 64.47,51.66 65.65,50.48 65.65,48.88 64.55,47.77 63.55,47.77 62.55,46.77 62.55,46.08 62.25,45.77 60.65,45.77 59.85,44.98 v59.85,43.27 | I2S0.7 28.48,1.81 28.48,3.36 29.8,4.69 41.23,4.69 v41.28,4.64
  Bottom 0.152: v59.85,43.27 59.85,40.48 58.25,38.88 58.25,12.56 58.31,12.5 58.31,1.23 55.75,-1.32 47.92,-1.32 45.04,1.55 | 45.04,1.55 I2S1.7 | v41.28,4.64 41.98,3.94 41.98,0.61 42.53,0.06 44.34,0.06 45.04,0.76 45.04,1.55
I2S0_FS  (via drill 0.35)
  Top 0.152: v39.25,3.07 39.75,3.57 44.25,3.57 47.65,6.98 52.65,6.98 56.55,10.88 57.25,10.88 57.55,11.18 v57.55,12.27 | v57.87,40.17 57.87,41.47 57.51,41.83 57.51,46.37 58.15,47.01 58.15,48.31 U$2.35 | I2S0.4 22.65,0.68 23.05,0.28 30.55,0.28 31.75,1.47 31.75,2.47 32.15,2.88 38.12,2.88 38.95,2.04 I2S1.4
  Bottom 0.152: I2S1.4 38.95,2.78 v39.25,3.07 | v57.55,12.27 57.55,40.17 v57.87,40.17
I2S0_SCLK  (via drill 0.35)
  Top 0.152: v22.05,29.48 22.85,30.27 24.95,30.27 25.25,30.58 25.25,31.3 25.31,31.36 25.31,33.13 25.55,33.38 v25.65,33.38 | v29,44.62 29,46.17 v28.15,47.02
  Bottom 0.152: I2S0.5 24.65,2.97 24.7,3.03 | 24.7,3.03 27.34,5.67 38.53,5.67 40.95,3.25 I2S1.5 | 24.7,3.03 21.65,6.07 21.65,9.98 22.25,10.57 22.25,13.07 18.05,17.27 18.05,26.38 21.15,29.48 v22.05,29.48 | v28.15,47.02 27.2,47.98 27.2,50.38 U$2.12 | 29.05,44.58 v29,44.62 29.19,44.43 29.19,42.55 29.2,42.54 29.2,38.92 25.65,35.38 v25.65,33.38
MCLK  (via drill 0.35)
  Top 0.152: v10.55,27.98 19.85,18.68 19.85,14.38 19.45,13.98 19.45,8.98 v19.85,8.57 | I2S0.3 20.65,0.68 21.45,-0.12 31.55,-0.12 31.75,0.07 v31.75,0.28 | I2S1.3 36.95,1.35 36.08,0.47 v33.95,0.47
  Bottom 0.152: I2S0.3 20.65,6.98 19.85,7.77 v19.85,8.57 | v10.55,27.98 -2.25,27.98 -3.05,28.77 -3.05,43.67 -2.05,44.67 2.85,44.67 JP1.3 | v31.75,0.28 31.95,0.47 v33.95,0.47
N$2
  Top 0.152: U$9.6 64.88,40.31 67,42.42 67.9,42.42 68.75,41.58 68.75,41.27 68.95,41.08 70.35,41.08 71.45,39.98 71.45,36.27 R3.1
N$3  (via drill 0.35)
  Top 0.152: v70.65,36.58 70.05,36.58 69.85,36.38 69.85,35.47 R3.2
  Top 0.2: R3.2 | v65.95,40.38 65.95,39.88 65.45,39.38 65.45,37.89 U$9.7
  Bottom 0.2: v70.65,36.58 70.65,38.77 68.75,40.67 66.25,40.67 v65.95,40.38
N$4
  Top 0.152: U$9.1 61.63,35.96 61.41,35.73 R1.7
N$5  (via drill 0.35)
  Top 0.2: v69.15,36.67 69.01,36.53 R3.3 | v66.45,39.27 66.18,39.01 U$9.8
  Bottom 0.2: v69.15,36.67 69.15,39.27 68.45,39.98 67.15,39.98 v66.45,39.27
N$6
  Top 0.152: U$9.9 66.85,37.79 66.85,37.48 68.21,36.12 R3.4
  Top 0.2: R3.4 68.1,35.42
N$7  (via drill 0.35)
  Top 0.152: U$9.23 64.88,43.14 65.35,42.67 65.35,41.77 64.85,41.27 v64.75,41.27
  Top 0.2: v65.45,36.67 66.05,36.08 R2.6 | 64.95,43.59 U$9.23
  Bottom 0.152: 65.35,38.58 65.45,38.48 v65.45,36.67
  Bottom 0.2: v64.75,41.27 64.75,39.17 65.35,38.58
N$8  (via drill 0.35)
  Top 0.152: U$9.25 63.55,43.69 63.55,44.81 C14.P$2 | U$11.#3 63.58,43.91 U$9.25 | U$9.25 63.58,41.41 v63.25,41.08
  Bottom 0.152: v63.25,41.08 63,40.83 R18.2
N$9
  Top 0.152: 28.27,38.1 28.3,38.08 | 47.95,38.98 47.88,39.05 U2.20 46.98,38.58 44.55,38.58 43.75,37.77 38.95,37.77 38.65,38.08 35.05,38.08 34.55,38.58 29.55,38.58 29.08,38.1 28.27,38.1 | GPIO4.I/O 27.5,39.24 27.5,38.73 28.12,38.1 28.27,38.1
N$10
  Top 0.152: R1.6 62.21,37.73 U$9.2
N$11
  Top 0.152: U$9.3 62.93,35.59 R1.5
N$12
  Top 0.152: U$9.4 63.55,37.77 63.55,36.02 64.1,35.48 R2.8
N$13
  Top 0.152: U$7.1 26.05,44.77 26.05,44.23 25.2,43.38 22.4,43.38 19.55,40.52 17.9,40.52 SERIAL.RX
N$14
  Bottom 0.152: C4.2 2.02,18.95 U1.27
N$15
  Top 0.152: U2.18 47.35,40.45 44.83,40.45 43.65,39.27 41.9,39.27 41.75,39.42 41.75,41.17 41.05,41.88 37.7,41.88 36.2,40.38 GPIO5.I/O
N$16
  Bottom 0.152: 2.45,16.61 U1.26 2.52,18.25 2.85,18.57 2.85,20.23 2.25,20.83 C4.1
N$17
  Top 0.152: GPIO6.I/O 43.85,40.38 44.48,41 U2.17
N$18  (via drill 0.35)
  Top 0.152: U2.16 48.27,41.65 48.75,41.17 48.75,38.27 48.15,37.67 46.85,37.67 46.55,37.38 46.55,36.77 46.25,36.48 20.55,36.48 19.95,35.88 14.25,35.88 v14.15,35.77
  Bottom 0.152: v14.15,35.77 13.35,34.98 10.75,34.98 9.95,34.17 GPIO12.I/O
N$19
  Bottom 0.152: U1.28 1.45,16.61 1.45,17.88 1.25,18.07 0.85,18.07 0.55,18.38 C5.1
N$20  (via drill 0.35)
  Top 0.152: v48.75,42.08 48.55,42.08 48.33,42.3 U2.15 | GPIO13.I/O 18.18,30.24 20.05,28.38 v44.25,28.38
  Bottom 0.152: v44.25,28.38 48.15,32.27 48.15,41.48 v48.75,42.08
N$21
  Bottom 0.152: U1.29 0.95,16.61 0.95,17.48 0.65,17.77 0.25,17.77 -0.45,18.48 -0.45,20.27 0.1,20.83 C5.2
N$22  (via drill 0.35)
  Top 0.152: v45.65,41.77 45.95,42.08 45.95,42.77 46.12,42.95 U2.14 | GPIO16.I/O 26.45,31.73 26.45,30.62 27.4,29.67 v42.85,29.67
  Bottom 0.152: v42.85,29.67 43.95,29.67 45.85,31.58 | 45.85,31.58 45.95,31.67 | v45.65,41.77 45.85,41.58 45.85,36.67 47.65,34.88 47.65,33.77 47.25,33.38 46.55,33.38 45.85,32.67 45.85,31.58
N$23
  Bottom 0.152: U1.5 13.02,19.16 R19.2
N$24
  Bottom 0.152: C2.2 13.55,18.82 13.55,16.57 U1.4
N$25
  Bottom 0.152: C1.2 15.3,19.12 14.02,17.84 U1.3
N$26
  Bottom 0.152: 5.57,16.48 U1.20 5.52,17.45 5.85,17.77 7.05,17.77 | 10.55,20.02 R25.1 10.75,19.98 10.75,19.62 10.75,19.07 10.45,18.77 9.75,18.77 8.75,17.77 7.05,17.77 | 7.05,17.77 6.95,17.68 6.95,16.61 U1.17
N$27
  Bottom 0.152: D1.ANODE 7.27,21.62 R26.1 C3.2 10.65,21.62 R25.2
N$28  (via drill 0.35)
  Top 0.152: U2.10 52.75,45.2 v52.75,45.58
  Bottom 0.152: R24.2 53.05,45.27 v52.75,45.58 52.75,45.28 R23.1 51.75,44.37
N$29
  Top 0.152: U2.13 49.23,43.6 49.65,43.17 49.65,33.58 47.75,31.67 42.86,31.67 GPIO27.I/O
N$30
  Top 0.152: U$7.8 22.25,45.27 19.9,45.27 18.85,46.33 18.55,46.33 15.8,43.58 15.8,40.42 SERIAL.TX
N$31  (via drill 0.35)
  Top 0.152: v40.35,15.57 IC3.3
  Bottom 0.152: R12.2 R15.2 41.1,14.82 v40.35,15.57
N$32  (via drill 0.35)
  Top 0.152: U2.1 50.27,39.05 50.15,39.17 50.15,45.58 v49.95,45.77 | v18.7,45.48 16.75,43.52 16.75,39.48 | 16.75,39.48 16.75,39.38 | 16.75,39.48 16.15,38.88 v10.95,38.88 | JP1.1 2.95,38.38 5.15,36.17 6.85,36.17 v7.05,36.38
  Bottom 0.152: v49.95,45.77 49.85,45.77 49.35,46.27 28.58,46.27 28.08,45.77 19,45.77 v18.7,45.48 | v7.05,36.38 7.35,36.67 8.25,36.67 10.45,38.88 v10.95,38.88
N$33  (via drill 0.35)
  Top 0.152: IC1.7 23.02,18.8 v22.55,19.27 22.38,19.1 IC1.8
  Bottom 0.152: v22.55,19.27 21.3,20.52 R9.1
N$34  (via drill 0.35)
  Top 0.152: v36.65,14.38 36.65,13.68 36.85,13.48 IC3.1
  Bottom 0.152: 26.06,7.96 R4.2 | v36.65,14.38 37.15,14.88 38.15,14.88 38.95,14.07 38.95,10.38 34.71,6.13 27.06,6.13 26.13,7.06 26.13,7.96 26.06,7.96 | R10.2 24.7,7.96 26.06,7.96
N$35
  Bottom 0.152: SERIAL.VCC 13.9,40.23 13.9,38.92 16.54,36.28 JP2.1
N$36  (via drill 0.35)
  Top 0.152: v38.3,16.34 39.08,15.56 IC3.2
  Bottom 0.152: R11.2 33.2,12.18 R14.2 33.2,14.52 35.01,16.34 v38.3,16.34
N$38  (via drill 0.35)
  Top 0.152: v42.75,15.57 42.35,15.57 41.62,14.84 IC3.4
  Bottom 0.152: R13.2 R16.2 47.3,15.57 v42.75,15.57
N$39
  Top 0.152: S1.A1 61.94,13.79 63.45,12.27 63.45,9.88 LED1.ANODE
  Top 1: P1.P$2 59.35,12.86 S1.A1 S1.A2
  pour Top (no thermals): 58.25,9.32 59.15,8.43 59.65,8.43 60.05,8.82 60.05,11.02 62.1,13.07 62.1,18.93 61.55,19.48 58.8,19.48 57.6,18.27 57.6,13.88 58.5,12.98 58.5,10.38 58.2,10.07 58.2,9.27
N$40
  Top 0.254: C16.2 29.55,14.23 U7.4
N$41
  Top 1: S1.K 54.95,18.75 U$12.K 61.75,21.08 63.05,19.77 67.1,19.77 | 67.1,19.77 C12.1 | C100.PLUS 65,17.68 67.1,19.77 | PWM3.VCC 66.93,19.95 67.1,19.77
  Top 2: PWM3.VCC PWM2.VCC PWM1.VCC PWM0.VCC
  pour Top (no thermals): 48.95,13.02 55.05,13.02 55.8,13.77 55.8,19.38 56.6,20.18 62.05,20.18 63.6,18.62 63.6,13.82 64.1,13.32 66.2,13.32 66.35,13.48 66.35,17.52 67.9,19.07 67.9,30.52 67.55,30.88 66.1,30.88 65.8,30.58 65.8,20.88 65.55,20.62 63.45,20.62 62.2,21.88 58.1,21.88 57.9,21.67 54.2,21.67 54,21.48 54,21.02 52.5,19.52 49.25,19.52 48.9,19.18 48.9,13.07
N$42
  Top 1: J1.1 62.35,8.27 P1.P$1
  Top 1.27: J1.1 J1.A1
  pour Top (no thermals): 63.5,0.18 63.15,0.53 63.15,5.82 61.45,7.52 61.45,10.93 61.8,11.27 62.65,11.27 62.75,11.18 62.95,10.98 62.95,10.93 62.95,8.52 63.05,8.43 63.8,7.68 64.85,7.68 65.4,7.68 65.45,7.62 65.9,7.18 65.9,6.98 65.9,3.07 65.7,2.88 65.5,2.68 65.5,0.22 65.35,0.07 65.3,0.07 63.65,0.07 63.55,0.18 63.5,0.12
N$43  (via drill 0.35)
  Top 0.152: U$9.5 64.25,37.79 64.25,39.08 v63.85,39.48 | R2.7 65.1,35.62 65.1,36.02 64.5,36.62 v64.3,36.62
  Bottom 0.152: v63.85,39.48 63.35,38.98 SJ5.2 SJ5.3 64.22,33.59 64.22,33.56 64.3,33.64 v64.3,36.62
N$44  (via drill 0.35)
  Top 0.152: v67.95,39.08 67.95,40.99 v67.35,41.59 | U$9.24 64.23,42.59 v64.35,42.48 | R2.5 66.7,35.62 v66.7,36.48
  Bottom 0.152: v64.35,42.48 64.95,42.48 65.83,41.59 v67.35,41.59 | v66.7,36.48 67.35,36.48 67.53,36.29 67.53,34.24 67.96,33.81 SJ2.3 68.01,33.62 68.75,33.62 SJ2.2 68.75,34.62 68.15,35.23 68.15,38.17 67.9,38.42 67.9,39.02 v67.95,39.08
N$45  (via drill 0.35)
  Top 0.152: U$7.6 21.75,46.38 21.55,46.58 21.55,47.12 21.4,47.27 19.65,47.27 v19.25,46.88
  Bottom 0.152: R17.1 17.3,46.67 18,47.38 19.2,47.38 19.25,47.33 v19.25,46.88 19.85,46.27 22.95,46.27 23,46.33 24.65,46.33 | 24.75,46.92 R21.2 24.65,46.33 | 24.65,46.33 24.6,46.27
N$46  (via drill 0.35)
  Top 0.152: v7.25,15.07 7.05,15.27 v7.05,24.38
  Bottom 0.152: U1.16 7.52,15.34 v7.25,15.07 | R6.2 6.3,23.62 v7.05,24.38 6.95,24.48 4.75,24.48 4.65,24.38 SJ6.2 | R6.2 5.61,23.59 | SJ6.3 3.49,23.62 R6.2
N$47
  Bottom 0.152: SJ6.1 3.41,25.12 R20.1
N$48  (via drill 0.35)
  Top 0.152: GPIO17.I/O 34.55,34.27 35.95,35.67 46.95,35.67 47.45,36.17 v47.45,36.77 | v45.25,43.17 45.3,43.12 46.42,44.25 U2.12
  Bottom 0.152: v47.45,36.77 47.45,41.17 45.45,43.17 v45.25,43.17
N$50
  Top 0.152: U$11.#1 66.59,46.31 R7.P$1 R22.P$2
N$51
  Top 0.254: LED1.CATHODE 66.35,8.98 R5.1
N$52  (via drill 0.35)
  Top 0.152: R1.8 60.45,35.68 v60.45,37.08
  Bottom 0.152: v60.45,37.08 60.45,38.23 R18.1
N$53  (via drill 0.35)
  Top 0.152: JP3.2 31.45,44.52 v31.1,44.17 | v24.6,44.27 24.5,44.38 24.5,45.23 23.8,45.92 22.4,45.92 U$7.7 21.6,45.88 21.5,45.77 20.95,45.77 C19.1
  Bottom 0.152: v31.1,44.17 30.8,44.17 29.35,45.62 28.75,45.62 27.8,44.67 27.8,44.33 27.2,43.73 25.15,43.73 v24.6,44.27
PWM0
  Top 0.152: PWM0.I/O 64.4,31.33 64.65,31.58 69.55,31.58 70.61,32.63 R3.8
PWM1
  Top 0.152: PWM1.I/O 63.17,27.26 62.25,28.17 62.25,31.67 62.55,31.98 69.25,31.98 69.81,32.53 R3.7
PWM2
  Top 0.152: PWM2.I/O 62.71,24.72 61.85,25.58 61.85,32.08 62.15,32.38 68.65,32.38 69.01,32.73 R3.6
PWM3
  Top 0.152: PWM3.I/O 64.29,22.09 63.15,22.09 61.45,23.8 61.45,32.48 61.75,32.77 67.95,32.77 68.21,33.03 R3.5
RX
  Top 0.152: U$2.10 24.65,50.38 24.65,47.77 24.55,47.67 24.55,47.02 24.7,46.88 U$7.4
SCL  (via drill 0.35)
  Top 0.152: 60.25,47.88 60.22,47.85 | 60.22,47.85 58.25,45.88 58.25,42.67 59.45,41.48 62.25,41.48 62.95,42.17 62.95,43.64 U$9.26 | v12.45,18.18 v12.45,14.68 | 20.88,12.07 v20.85,12.07 23.35,12.07 23.67,12.4 IC1.3 23.67,15 23.95,15.27 25.45,15.27 R8.3 | v10.65,42.88 14.11,42.88 20.35,49.12 U$2.5 20.85,49.41 21.55,50.11 21.55,50.14 22.17,50.77 22.17,52.62 22.53,52.97 59.75,52.97 60.25,52.47 60.25,51.02 60.75,50.52 60.75,50.23 60.22,49.7 60.22,47.85
  Bottom 0.152: v10.65,42.88 10.65,43.67 7.35,46.98 -2.35,46.98 -3.75,45.58 -3.75,28.38 -2.85,27.48 -2.85,26.48 -3.1,26.23 -3.1,12.73 | -3.15,12.77 -3.1,12.73 | -3.1,12.73 -0.45,10.07 7.75,10.07 9.02,11.34 U1.13 9.02,17.34 9.95,18.27 12.35,18.27 v12.45,18.18 | v12.45,14.68 15.05,12.07 v20.85,12.07
SDA  (via drill 0.35)
  Top 0.152: v11.45,44.08 13.65,44.08 18.31,48.73 U$2.3 19.55,50.35 19.55,52.58 20.45,53.47 62.05,53.47 62.81,52.71 62.81,48.44 62.05,47.67 60.85,47.67 58.85,45.67 58.85,43.17 59.75,42.27 61.65,42.27 62.28,42.91 U$9.27 | IC1.4 24.33,13.68 | 24.33,13.68 24.33,11.45 23.75,10.88 v20.85,10.88 | R8.4 24.85,13.68 24.33,13.68
  Bottom 0.152: v20.85,10.88 14.25,10.88 | 14.25,10.88 10.15,10.88 7.45,8.18 -2.45,8.18 -4.75,10.48 -4.75,47.48 -3.75,48.48 8.25,48.48 8.95,47.77 8.95,46.27 11.15,44.08 v11.45,44.08 | U1.12 9.52,15.11 9.65,14.98 9.95,14.98 | 9.95,14.98 10.02,15.05 U1.11 | 9.95,14.98 10.85,14.98 14.25,11.57 14.25,10.88
SPI0_CS0  (via drill 0.35)
  Top 0.152: IC3.10 45.42,19.95 45.75,20.27 51.88,20.27 54,22.4 57.28,22.4 58.65,23.77 58.65,28.38 55,32.02 v55,33.67 | v43.85,45.48 42.45,46.88 42.45,50.4 U$2.24
  Bottom 0.152: v55,33.67 54.95,33.73 54.95,39.58 48.75,45.77 44.15,45.77 v43.85,45.48
SPI0_MISO  (via drill 0.35)
  Top 0.152: U$2.21 41.17,47.8 41.15,47.77 41.15,46.88 42.05,45.98 42.05,43.88 v41.75,43.58 | IC3.12 42.88,20.31 43.85,21.27 51.25,21.27 53.55,23.58 56.55,23.58 57.35,24.38 57.35,28.17 52.95,32.58 v52.95,36.58
  Bottom 0.152: v41.75,43.58 42.51,44.33 48.88,44.33 52.95,40.26 v52.95,36.58
SPI0_MOSI  (via drill 0.35)
  Top 0.152: IC3.11 44.16,20.18 44.75,20.77 51.65,20.77 53.85,22.98 56.95,22.98 58.05,24.08 58.05,28.27 54.05,32.27 v54.05,34.77 | v41.05,44.88 40.25,44.88 38.63,46.49 U$2.19
  Bottom 0.152: v54.05,34.77 54.05,39.88 49.15,44.77 41.15,44.77 v41.05,44.88
SPI0_SCLK  (via drill 0.35)
  Top 0.152: IC3.13 41.62,20.34 43.05,21.77 50.95,21.77 53.35,24.17 56.35,24.17 56.85,24.67 56.85,27.88 51.95,32.77 v51.95,37.58 | v43.45,43.38 43.45,44.08 44.85,45.48 44.85,47.98 U$2.23
  Bottom 0.152: v51.95,37.58 51.95,40.38 48.49,43.83 44.82,43.83 44.36,43.38 v43.45,43.38
TX
  Top 0.152: U$2.8 23.39,51.05 22.15,49.81 22.15,48.23 22.8,47.58 22.8,47.17 22.5,46.88 U$7.5

## Text on the board
tPlace: Designed in Aizu | MCLK | 1 | SERIAL | G4 | #519 | REV 1.0.12
bPlace: GPIO LEVEL | SERIAL POWER OUTPUT | 5V | 33V | PCA9685 ADDRESS | F-519-1-12-A-N-J-0-P | OLED ADRESS